# EAGLE design InterfaceBoard (EAGLE 6.5.0)
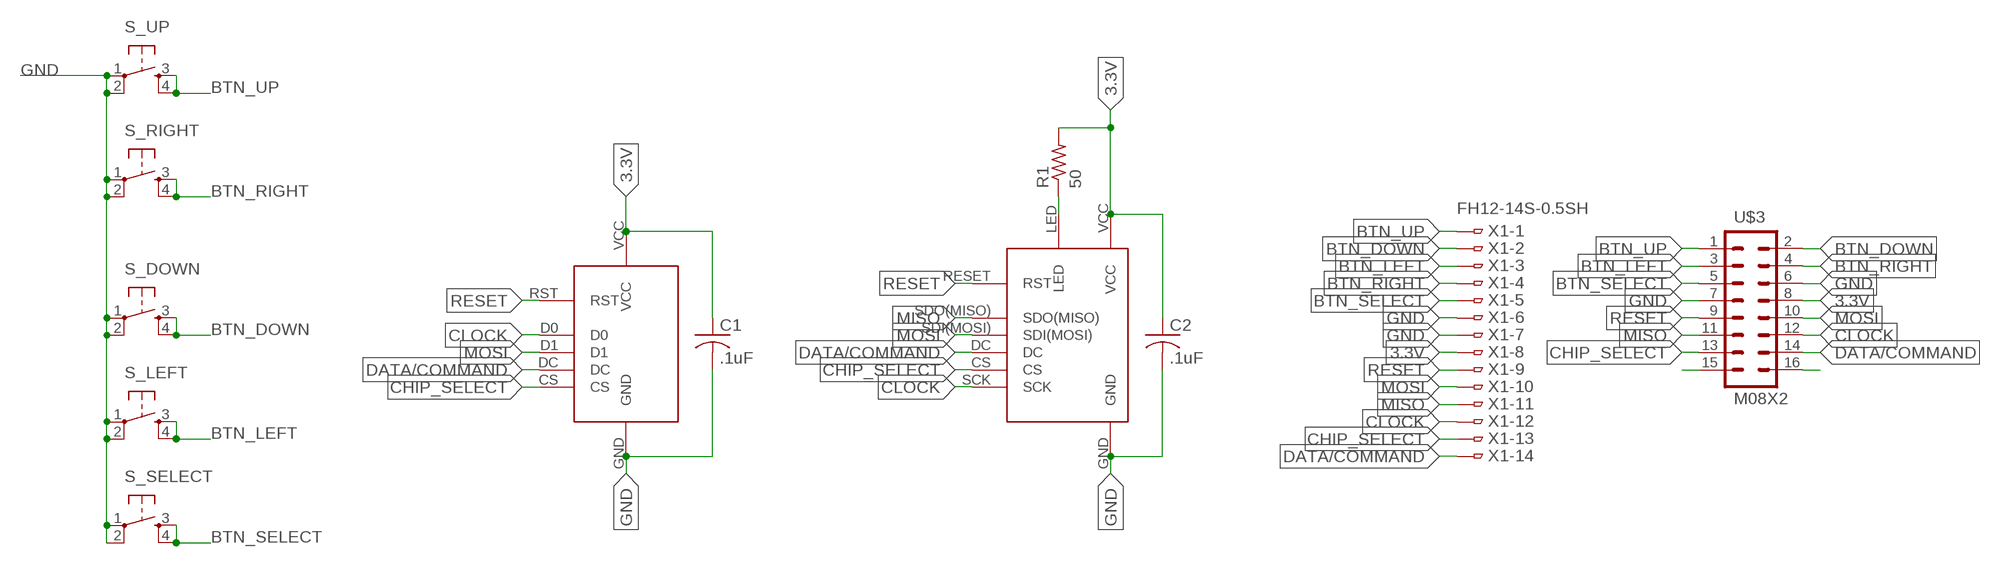
[diagram p0: schematic, sheet 1]

## Parts
C1  .1uF  C-USC0603  [C0603]
C2  .1uF  C-USC0603  [C0603]
R1  50  R-US_R0603  [R0603]
S_DOWN  TAC_SWITCHSMD  [TACTILE_SWITCH_SMD]
S_LEFT  TAC_SWITCHSMD  [TACTILE_SWITCH_SMD]
S_RIGHT  TAC_SWITCHSMD  [TACTILE_SWITCH_SMD]
S_SELECT  TAC_SWITCHSMD  [TACTILE_SWITCH_SMD]
S_UP  TAC_SWITCHSMD  [TACTILE_SWITCH_SMD]
U$1  OLED_XYDZ_13  [OLED_XYDZ_13]
U$2  LCD_QDTECH_22  [LCD_QDTECH_22]
U$3  M08X2  [2X8]
X1  FH12-14S-0.5SH  [FH12-14S-0.5SH]

## Nets
3.3V: C1.1 C2.1 R1.2 U$1.VCC U$2.VCC U$3.8 X1.8
BTN_DOWN: S_DOWN.3 S_DOWN.4 U$3.2 X1.2
BTN_LEFT: S_LEFT.3 S_LEFT.4 U$3.3 X1.3
BTN_RIGHT: S_RIGHT.3 S_RIGHT.4 U$3.4 X1.4
BTN_SELECT: S_SELECT.3 S_SELECT.4 U$3.5 X1.5
BTN_UP: S_UP.3 S_UP.4 U$3.1 X1.1
CHIP_SELECT: U$1.CS U$2.CS U$3.13 X1.13
CLOCK: U$1.D0 U$2.SCK U$3.12 X1.12
DATA/COMMAND: U$1.DC U$2.DC U$3.14 X1.14
GND: C1.2 C2.2 S_DOWN.1 S_DOWN.2 S_LEFT.1 S_LEFT.2 S_RIGHT.1 S_RIGHT.2 S_SELECT.1 S_SELECT.2 S_UP.1 S_UP.2 U$1.GND U$2.GND U$3.6 U$3.7 X1.6 X1.7
MISO: U$2.SDO(MISO) U$3.11 X1.11
MOSI: U$1.D1 U$2.SDI(MOSI) U$3.10 X1.10
N$9: R1.1 U$2.LED
N$12: U$3.15
N$21: U$3.16
RESET: U$1.RST U$2.RESET(RST) U$3.9 X1.9

## Library data of the parts
C1 C2 = adafruit:C-US: CAPACITOR, American symbol
R1 = adafruit:R-US_: RESISTOR, American symbol
S_DOWN S_LEFT S_RIGHT S_SELECT S_UP = SparkFun-Electromechanical:TAC_SWITCH: Momentary Switch Button commonly used for reset or general input. Spark Fun Electronics SKU : COM-00097 SMT- SWCH-08247; PROD_ID: SWCH-08247
U$1 = blinkinlabs:OLED_XYDZ_13
U$2 = blinkinlabs:LCD_QDTECH_22
U$3 = SparkFun-Connectors:M08X2: .1" headers, two rows of 8 each
X1 = con-hirose:FH12-14S-0.5S: 0.5mm Pitch Connectors For FPC/FFC Source: Data sheet <http://www.hirose.co.jp/cataloge_hp/e58605370.pdf>; MPN: MC34827; OC_FARNELL: 1324544; OC_NEWARK: 41P0493

## Board
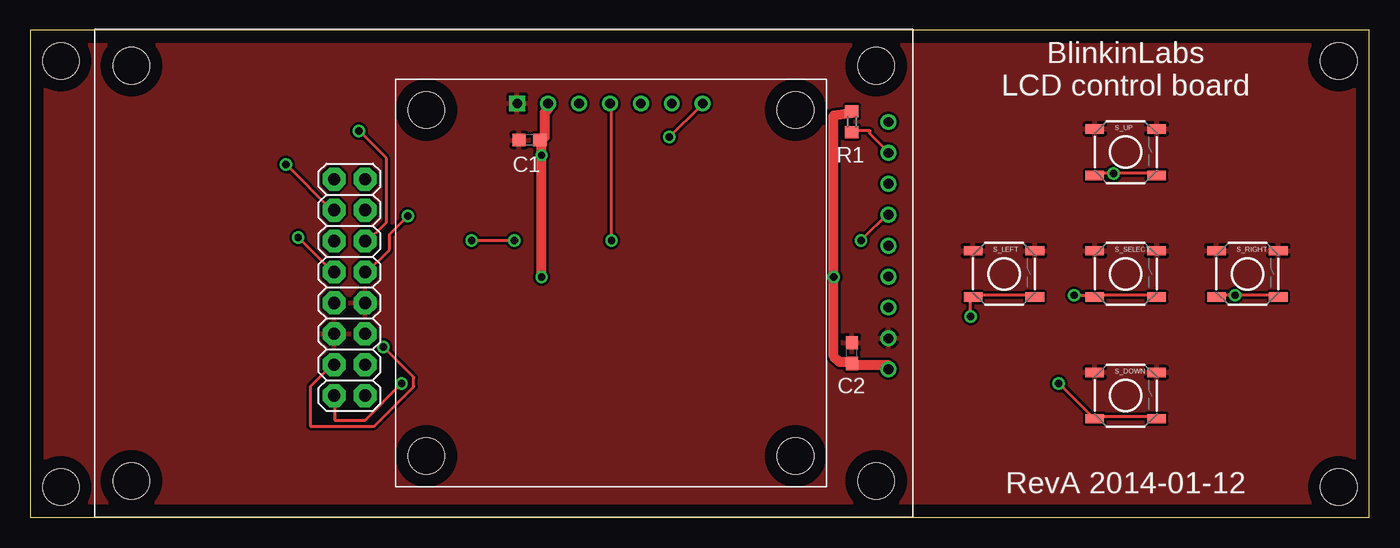
[diagram p1: board, top side]
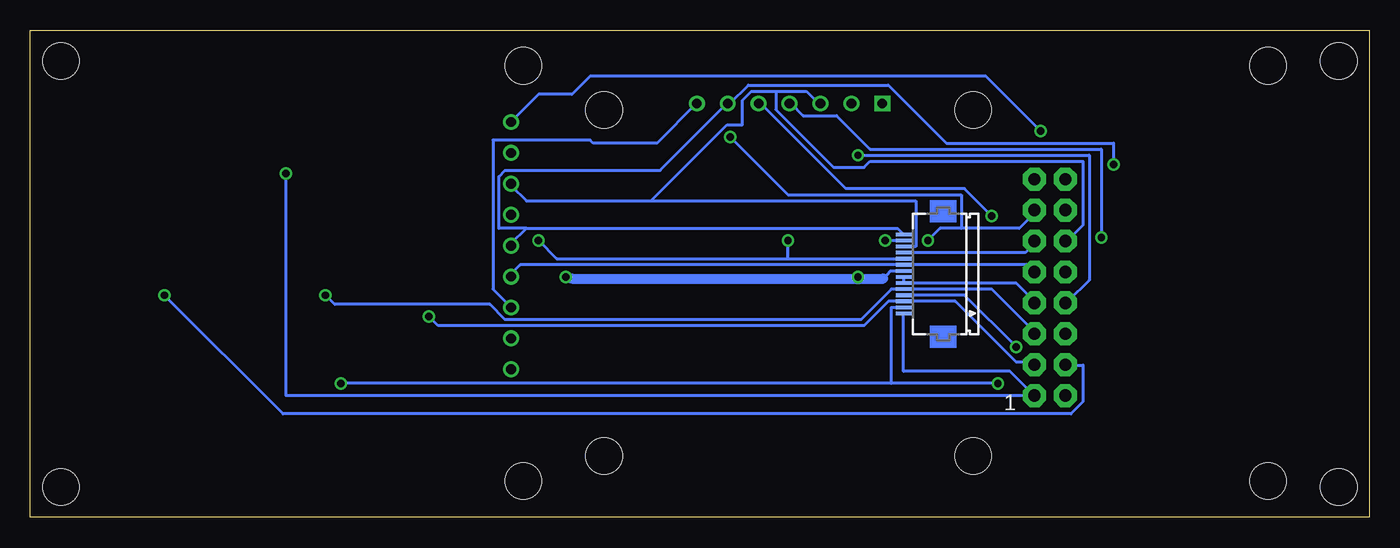
[diagram p2: board, bottom side, seen from below]

Size 110 x 40 mm. Coordinates in mm from the lower left corner, seen from the top.
Outline: 0,0 110,0 110,40 0,40 0,0
Copper layers (1*16): Top 0.035mm / dielectric 1.5mm / Bottom 0.035mm
Design rules "default": minimum track width 10mil, minimum drill 24mil, track to track 8mil, track to pad 8mil, pad to pad 8mil, via to via 8mil, smd to smd 8mil, copper to edge 40mil, drill to drill 8mil, minimum pad ring 10mil, minimum via ring 8mil, stop-mask expansion 4mil, vias tented up to drill 0mil, thermal gap 10mil
Holes 3 mm at 2.5,2.5 2.5,37.5 107.5,37.5 107.5,2.5

### Footprints (pad centres in the part's own frame; a part is rotated, then mirrored left to right if it is on the bottom)
C0603 = smd 1.1 x 1: 1 -0.85,0; 2 0.85,0
R0603 = smd 1 x 1.1: 1 -0.85,0; 2 0.85,0
TACTILE_SWITCH_SMD = smd 1.524 x 0.762: 1 -2.54,1.905; 2 2.54,1.905; 3 -2.54,-1.905; 4 2.54,-1.905
OLED_XYDZ_13 = drill 0.8: CS 25.24,31.5; D0 15.08,31.5; D1 17.62,31.5; DC 22.7,31.5; RST 20.16,31.5; VCC 12.54,31.5 | drill 0.8 square: GND 10,31.5 | hole 3: 2.54,30.96; 32.86,30.96; 32.86,2.54; 2.54,2.54
LCD_QDTECH_22 = drill 0.8: CS 2,22.86; DC 2,17.78; GND 2,25.4; LED 2,10.16; RESET 2,20.32; SCK 2,12.7; SDI(MOSI) 2,15.24; SDO(MISO) 2,7.62; VCC 2,27.94 | hole 3: 3,37.1; 64.2,37.1; 64.2,3; 3,3
2X8 = drill 1.016 pad 1.88 octagon: 1 0,0; 2 0,2.54; 3 2.54,0; 4 2.54,2.54; 5 5.08,0; 6 5.08,2.54; 7 7.62,0; 8 7.62,2.54; 9 10.16,0; 10 10.16,2.54; 11 12.7,0; 12 12.7,2.54; 13 15.24,0; 14 15.24,2.54; 15 17.78,0; 16 17.78,2.54
FH12-14S-0.5SH = smd 0.3 x 1.3: 1 -3.25,3.25; 2 -2.75,3.25; 3 -2.25,3.25; 4 -1.75,3.25; 5 -1.25,3.25; 6 -0.75,3.25; 7 -0.25,3.25; 8 0.25,3.25; 9 0.75,3.25; 10 1.25,3.25; 11 1.75,3.25; 12 2.25,3.25; 13 2.75,3.25; 14 3.25,3.25

### Placement (x,y rotation side)
C1  41,31 180 top
C2  67.5,13.5 90 top
R1  67.5,32.5 90 top
S_DOWN  90,10 0 top
S_LEFT  80,20 0 top
S_RIGHT  100,20 0 top
S_SELECT  90,20 0 top
S_UP  90,30 0 top
U$1  30,2.5 0 top
U$2  72.5,40.1 180 top
U$3  27.5,10 90 top
X1  35,20 90 bottom

### Tracks (layer width: path | path; a pad name or v marks a point on that pad's centre or on a via)
3.3V  (via drill 0.61)
  Top 0.254: 42.25,31.25 42,31 C1.1 | 42.5,34 U$1.VCC | U$2.VCC 70.5,12.5 | 67.5,12.5 C2.1 67.5,12.75 | 67.5,33.25 R1.2
  Top 0.813: 42.25,31.25 42.25,33.25 42.5,33.5 42.5,34 | 70.5,12.5 67.5,12.5 | 67.5,33.25 66,33.02 v66,19.75 66,13.25 66.5,12.75 67.5,12.75 | v42,19.75 v42,29.75 42,31
  Bottom 0.254: 39.91,19.61 39.34,20.25 X1.8 | 42,19.61 v42,19.75 | v42,29.75 23,29.75 23,19.5 24.75,17.75 U$3.8
  Bottom 0.813: 39.91,19.61 42,19.61 65.5,19.61 v66,19.75
BTN_DOWN  (via drill 0.61)
  Top 0.254: S_DOWN.4 92.5,8.25 87.5,8.25 S_DOWN.3 87.25,8.25 v84.5,11 | v30.5,11 27.5,8 25,8 25,10 U$3.2
  Bottom 0.254: X1.2 39.25,17.25 39.25,11 | v30.5,11 39.25,11 | 39.25,11 v84.5,11
BTN_LEFT  (via drill 0.61)
  Top 0.254: S_LEFT.4 82.5,18.25 77.5,18.25 S_LEFT.3 77.25,18 v77.25,16.5
  Bottom 0.254: U$3.3 27.5,12.75 29,12.75 34,17.75 X1.3 39.5,17.75 41.5,15.75 76.5,15.75 v77.25,16.5
BTN_RIGHT  (via drill 0.61)
  Top 0.254: S_RIGHT.3 97.5,18.25 v99,18.25 102.5,18.25 S_RIGHT.4 | v29,14 31.5,11.5 31.5,10.75 28.25,7.5 23,7.5 23,10.75 24.75,12.5 U$3.4
  Bottom 0.254: X1.4 33.25,18.25 v29,14 | v99,18.25 89.25,8.5 24.5,8.5 23.5,9.5 23.5,12.5 24.75,12.5 U$3.4
BTN_SELECT  (via drill 0.61)
  Top 0.254: S_SELECT.4 92.5,18.25 87.5,18.25 S_SELECT.3 87.25,18.25 v85.75,18.25
  Bottom 0.254: U$3.5 27.5,15.25 31,18.75 X1.5 39.25,18.75 41.75,16.25 71,16.25 72.25,17.5 85,17.5 v85.75,18.25
BTN_UP  (via drill 0.61)
  Top 0.254: S_UP.3 87.5,28.25 v89,28.25 92.5,28.25 S_UP.4
  Bottom 0.254: X1.1 38.25,12 29.5,12 U$3.1 89,10 v89,28.25
CHIP_SELECT  (via drill 0.61)
  Top 0.254: v36.25,22.75 v39.75,22.75 | v52.5,31.25 55,33.75 55,34 U$1.CS
  Bottom 0.254: v39.75,22.75 X1.13 | v36.25,22.75 35.25,23.75 33.5,23.75 | 33.5,23.75 28.75,23.75 27.5,25 U$3.13 | U$2.CS 72,18.75 72,31 64,31 63.75,30.75 58.5,30.75 U$1.CS | 33.5,23.75 33.5,26.5 47.75,26.5 v52.5,31.25
CLOCK
  Bottom 0.254: X1.12 37.25,22.25 37.25,26 59,26 | 59,26 69.25,26 70.5,27.25 U$2.SCK | 48.75,35 50.75,35 51.5,34.25 51.5,32.25 52.75,32.25 59,26 | 48.75,35 46.25,35 45.25,34 U$1.D0 | 48.75,35 48.75,33.5 44,28.75 41.5,28.75 41,29.25 23.5,29.25 23.5,24 24.75,22.75 U$3.12
DATA/COMMAND  (via drill 0.61)
  Top 0.254: v21,29 24.75,25.25 U$3.14
  Bottom 0.254: X1.14 38.75,23.75 69.25,23.75 | 69.25,23.75 70.5,22.5 U$2.DC | 69.25,23.75 71.5,23.75 71.5,28 71,28.5 58.25,28.5 52.75,34 U$1.DC 52.5,34 51,35.5 39.5,35.5 34.75,30.75 21,30.75 v21,29
GND
  Bottom 0.254: X1.7 X1.6 29,19.25 27.5,17.75 U$3.7
  pour Top: 0,40 110,40 110,0 0,0
MISO  (via drill 0.61)
  Top 0.254: v27,31.75 29.25,29.5 29.25,24.25 27.5,22.5 U$3.11
  Bottom 0.254: X1.11 28.25,21.75 27.5,22.5 U$3.11 | v27,31.75 31.5,36.25 64,36.25 65.5,34.75 68.25,34.75 70.5,32.5 U$2.SDO(MISO)
MOSI  (via drill 0.61)
  Top 0.254: v68.25,22.75 70.5,25 U$2.SDI(MOSI) | v47.75,22.75 47.75,34 U$1.D1 | v22,23 24.75,20.25 U$3.10
  Bottom 0.254: 47.75,21.25 66.75,21.25 v68.25,22.75 | 47.75,21.25 X1.10 | 47.75,21.25 v47.75,22.75 | v22,23 22,30.25 41,30.25 43.75,33 46.5,33 47.5,34 U$1.D1
N$9
  Top 0.254: R1.1 67.5,31.75 69,31.75 69,31.5 70.5,30 U$2.LED
RESET  (via drill 0.61)
  Top 0.254: v31,24.75 29.5,23.25 29.5,22 27.5,20 U$3.9
  Bottom 0.254: U$3.9 27.5,20.25 28,20.75 X1.9 69.75,20.75 70.5,20 U$2.RESET | v31,24.75 33.25,27 43,27 50,34 U$1.RST

### Text on the board
tNames: BlinkinLabs / LCD control board | RevA 2014-01-12
bNames: 1